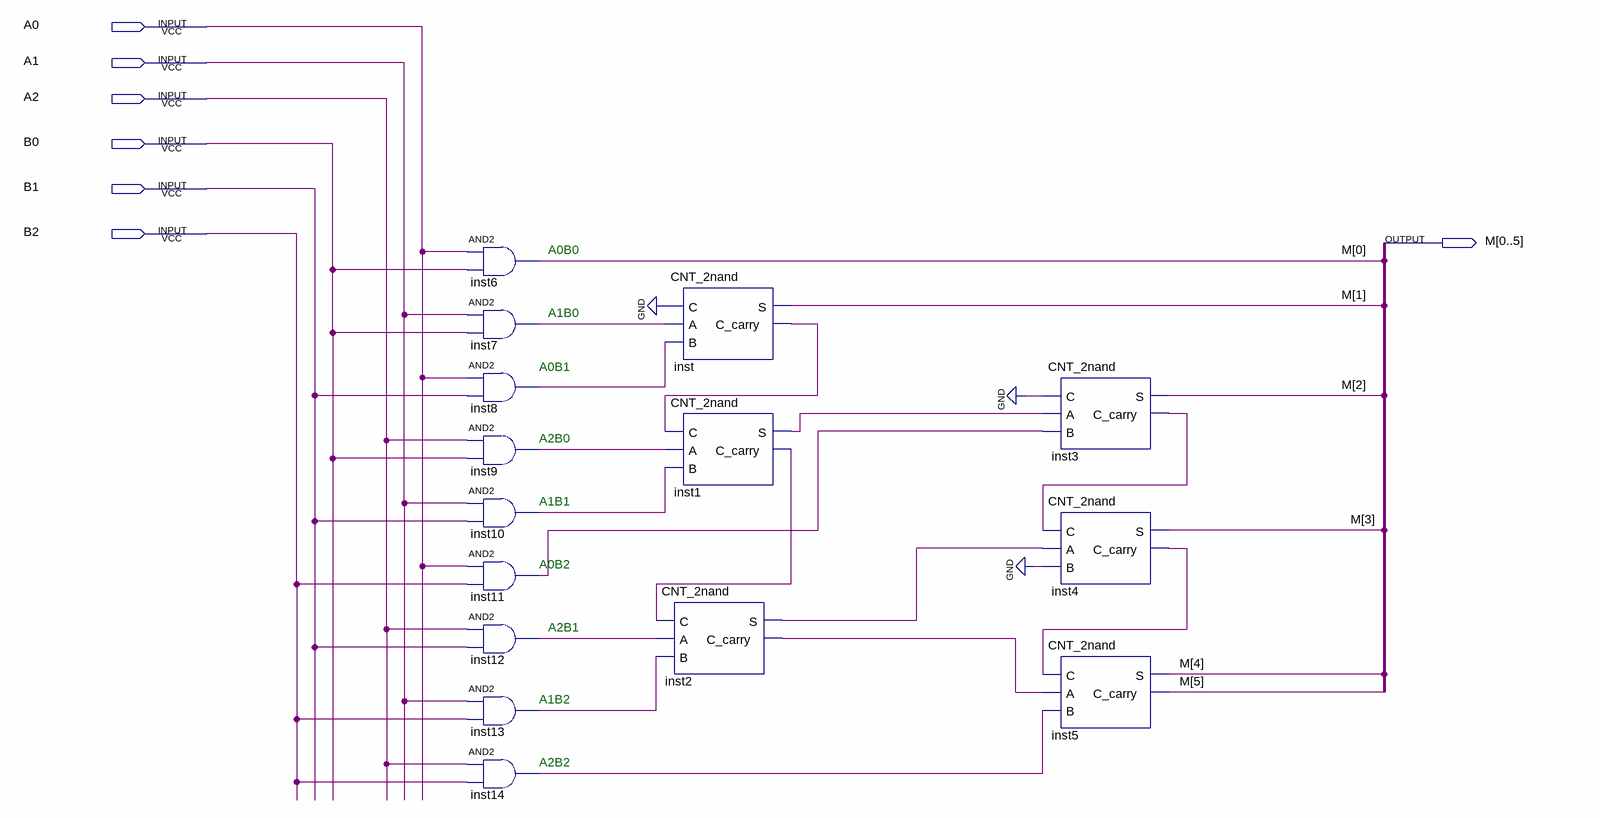
[diagram p0: schematic sheet]
// Quartus schematic Multiplier3x3.bdf as structural Verilog: 15 symbols, 7 pins
module Multiplier3x3 (
  input  A0,
  input  A1,
  input  A2,
  input  B0,
  input  B1,
  input  B2,
  output [0:5] M
);

  wire inst1_c_carry, inst1_s, inst2_c_carry, inst2_s, inst3_c_carry, inst4_c_carry, inst7_out, inst8_out,
       inst9_out, inst10_out, inst11_out, inst12_out, inst13_out, inst14_out, inst_c_carry;

  and inst6 (M[0], A0, B0);
  and inst7 (inst7_out, A1, B0);
  and inst8 (inst8_out, A0, B1);
  and inst9 (inst9_out, A2, B0);
  and inst10 (inst10_out, A1, B1);
  and inst11 (inst11_out, A0, B2);
  and inst12 (inst12_out, A2, B1);
  and inst13 (inst13_out, A1, B2);
  and inst14 (inst14_out, A2, B2);
  CNT_2nand inst (.C(1'b0), .A(inst7_out), .B(inst8_out), .S(M[1]), .C_carry(inst_c_carry));
  CNT_2nand inst1 (.C(inst_c_carry), .A(inst9_out), .B(inst10_out), .S(inst1_s), .C_carry(inst1_c_carry));
  CNT_2nand inst2 (.C(inst1_c_carry), .A(inst12_out), .B(inst13_out), .S(inst2_s), .C_carry(inst2_c_carry));
  CNT_2nand inst3 (.C(1'b0), .A(inst1_s), .B(inst11_out), .S(M[2]), .C_carry(inst3_c_carry));
  CNT_2nand inst4 (.C(inst3_c_carry), .A(inst2_s), .B(1'b0), .S(M[3]), .C_carry(inst4_c_carry));
  CNT_2nand inst5 (.C(inst4_c_carry), .A(inst2_c_carry), .B(inst14_out), .S(M[4]), .C_carry(M[5]));

  // Notes on the sheet:
  //   A0B0
  //   A1B0
  //   A0B1
  //   A2B0
  //   A1B1
  //   A0B2
  //   A2B1
  //   A1B2
  //   A2B2
endmodule
